# EAGLE design DCS (EAGLE 6.5.0)

## Sheet 1 of 3: Main
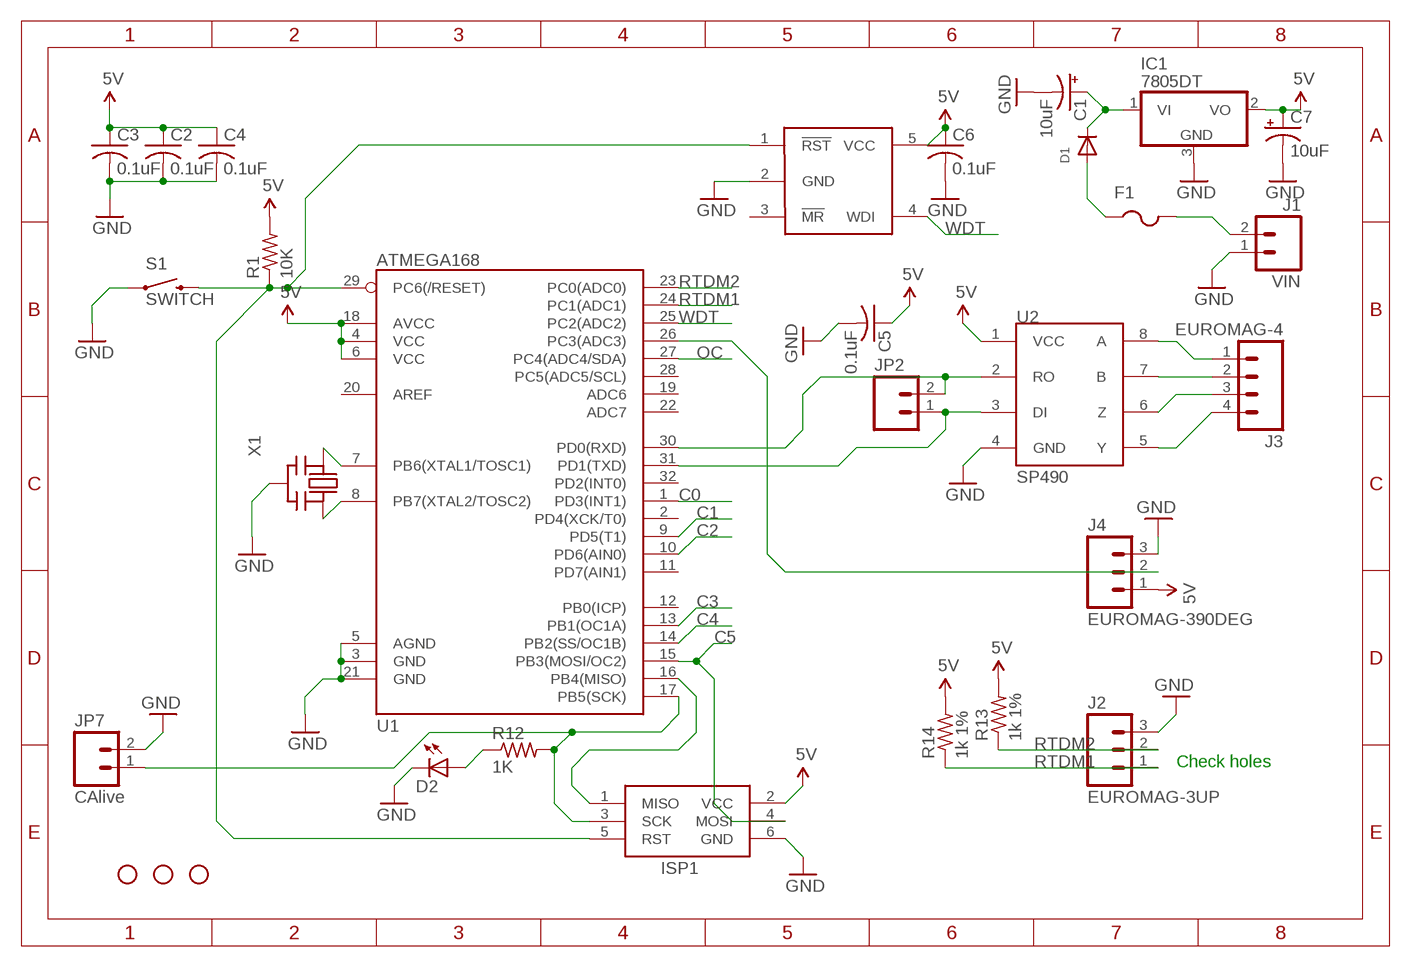
[diagram p0: schematic, sheet 1]

### Parts
C1  10uF  CPOL-USCT6032  [CT6032]
C2  0.1uF  C-USC0805  [C0805]
C3  0.1uF  C-USC0805  [C0805]
C4  0.1uF  C-USC0805  [C0805]
C5  0.1uF  C-USC0805  [C0805]
C6  0.1uF  C-USC0805  [C0805]
C7  10uF  CPOL-USCT3216  [CT3216]
D1  DIODESMA  [SMADIODE]
D2  LEDCHIPLED_0805  [CHIPLED_0805]
F1  PTCFUSE-1206  [R1206]
IC1  7805DT  [TO252]
ISP1  AVRISP-6  [AVRISP]
J1  VIN  EUROMAG-290DEG  [M2]
J2  EUROMAG-3UP  [M3-UP]
J3  EUROMAG-4  [M4]
J4  EUROMAG-390DEG  [M3]
JP1  STAND-OFF  [STAND-OFF]
JP2  M02LOCK  [1X02_LOCK]
JP3  STAND-OFF  [STAND-OFF]
JP5  STAND-OFF  [STAND-OFF]
JP7  CAlive  M02POLAR_LOCK  [MOLEX-1X2_LOCK]
R1  10K  R-US_M0805  [M0805]
R12  1K  R-US_M0805  [M0805]
R13  1k 1%  R-US_M0805  [M0805]
R14  1k 1%  R-US_M0805  [M0805]
S1  SWITCH  SWITCH-MOMENTARY-2PTH  [TACTILE-PTH]
U1  ATMEGA168  [TQFP32-08]
U2  SP490  ISL83077  [SO08]
U3  MAX823  [SOT23-5L]
X1  CERMOSCILL-AWCSR  [AWCSR]

### Nets
5V: C2.1 C3.1 C4.1 C5.1 C6.1 C7.+ IC1.2(VO) ISP1.2(VCC) J4.1 R1.2 R13.2 R14.2 U1.4(VCC) U1.6(VCC) U1.18(AVCC) U2.1(VCC) U3.5(VCC) ; also sheet 2
C0: U1.1(PD3(INT1)) ; also sheet 2
C1: U1.9(PD5(T1)) ; also sheet 2
C2: U1.10(PD6(AIN0)) ; also sheet 2
C3: U1.13(PB1(OC1A)) ; also sheet 2
C4: U1.14(PB2(SS/OC1B)) ; also sheet 2
C5: ISP1.4(MOSI) U1.15(PB3(MOSI/OC2)) ; also sheet 2
GND: C1.- C2.2 C3.2 C4.2 C5.2 C6.2 C7.- D2.C IC1.3(GND) ISP1.6(GND) J1.1 J2.3 J4.3 JP7.2 S1.1 U1.3(GND) U1.5(AGND) U1.21(GND) U2.4(GND) U3.2(GND) X1.2(GND) ; also sheet 2,3
N$1: JP2.2 U1.30(PD0(RXD)) U2.2(RO)
N$2: F1.2 J1.2
N$3: JP2.1 U1.31(PD1(TXD)) U2.3(DI)
N$4: ISP1.5(RST) R1.1 S1.3 U1.29(PC6(/RESET)) U3.1(!RST)
N$5: U1.8(PB7(XTAL2/TOSC2)) X1.3(OUT)
N$6: J3.1 U2.8(A)
N$7: ISP1.1(MISO) U1.16(PB4(MISO))
N$8: D1.A F1.1
N$9: U1.7(PB6(XTAL1/TOSC1)) X1.1(IN)
N$10: D2.A R12.1
N$11: J3.2 U2.7(B)
N$12: J3.3 U2.6(Z)
N$13: C1.+ D1.C IC1.1(VI)
N$15: J3.4 U2.5(Y)
N$17: J4.2 U1.26(PC3(ADC3))
OC: U1.27(PC4(ADC4/SDA)) ; also sheet 3
RTDM1: J2.1 R14.1 U1.24(PC1(ADC1))
RTDM2: J2.2 R13.1 U1.23(PC0(ADC0))
SCLK: ISP1.3(SCK) JP7.1 R12.2 U1.17(PB5(SCK))
WDT: U1.25(PC2(ADC2)) U3.4(WDI)
Unconnected: U1.2(PD4(XCK/T0)) U1.11(PD7(AIN1)) U1.12(PB0(ICP)) U1.19(ADC6) U1.20(AREF) U1.22(ADC7) U1.28(PC5(ADC5/SCL)) U1.32(PD2(INT0)) U3.3(!MR)

### Notes on the sheet
- Check holes

## Sheet 2 of 3: PWM
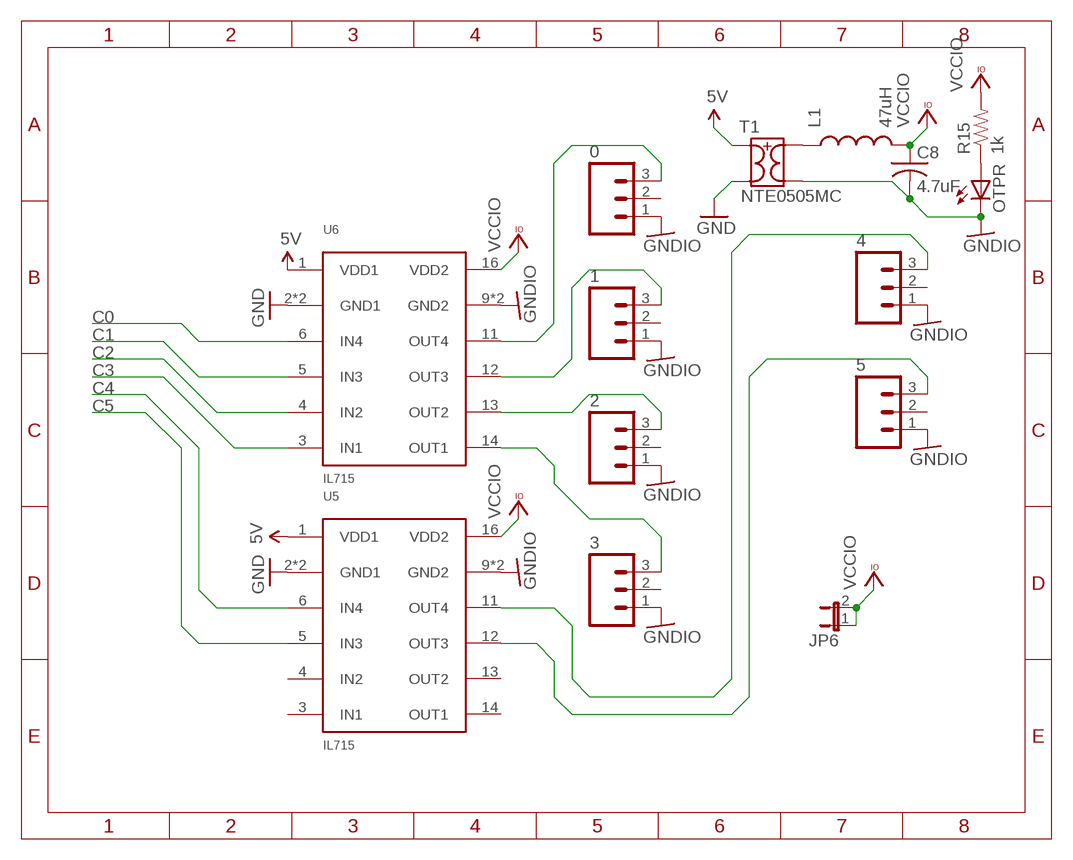
[diagram p1: schematic, sheet 2]

### Parts
0  M03PTH  [1X03]
1  M03PTH  [1X03]
2  M03PTH  [1X03]
3  M03PTH  [1X03]
4  M03PTH  [1X03]
5  M03PTH  [1X03]
C8  4.7uF  C-USC0805  [C0805]
JP6  JUMPER-2SMD-NO  [SJ_2S-NO]
L1  47uH  INDUCTOR1  [0805]
OTPR  LEDCHIP-LED0805  [CHIP-LED0805]
R15  1k  RESISTOR0805-RES  [0805]
T1  NTE0505MC  [SO-8FT]
U5  IL715  [S016]
U6  IL715  [S016]

### Nets
5V: T1.3 U5.1(VDD1) U6.1(VDD1) ; also sheet 1
C0: U6.6(IN4) ; also sheet 1
C1: U6.5(IN3) ; also sheet 1
C2: U6.4(IN2) ; also sheet 1
C3: U6.3(IN1) ; also sheet 1
C4: U5.6(IN4) ; also sheet 1
C5: U5.5(IN3) ; also sheet 1
GND: T1.1 U5.2(GND1) U5.8(GND1) U6.2(GND1) U6.8(GND1) ; also sheet 1,3
GNDIO: 0.1 1.1 2.1 3.1 4.1 5.1 C8.2 OTPR.C T1.7 U5.9(GND2) U5.15(GND2) U6.9(GND2) U6.15(GND2)
N$14: OTPR.A R15.1
N$16: L1.1 T1.8
N$32: 0.3 U6.11(OUT4)
N$33: 2.3 U6.13(OUT2)
N$35: 3.3 U6.14(OUT1)
N$36: 4.3 U5.11(OUT4)
N$37: 5.3 U5.12(OUT3)
N$38: 1.3 U6.12(OUT3)
VCCIO: C8.1 JP6.1 JP6.2 L1.2 R15.2 U5.16(VDD2) U6.16(VDD2)
Unconnected: 0.2 1.2 2.2 3.2 4.2 5.2 U5.3(IN1) U5.4(IN2) U5.13(OUT2) U5.14(OUT1)

## Sheet 3 of 3: Offset motor control
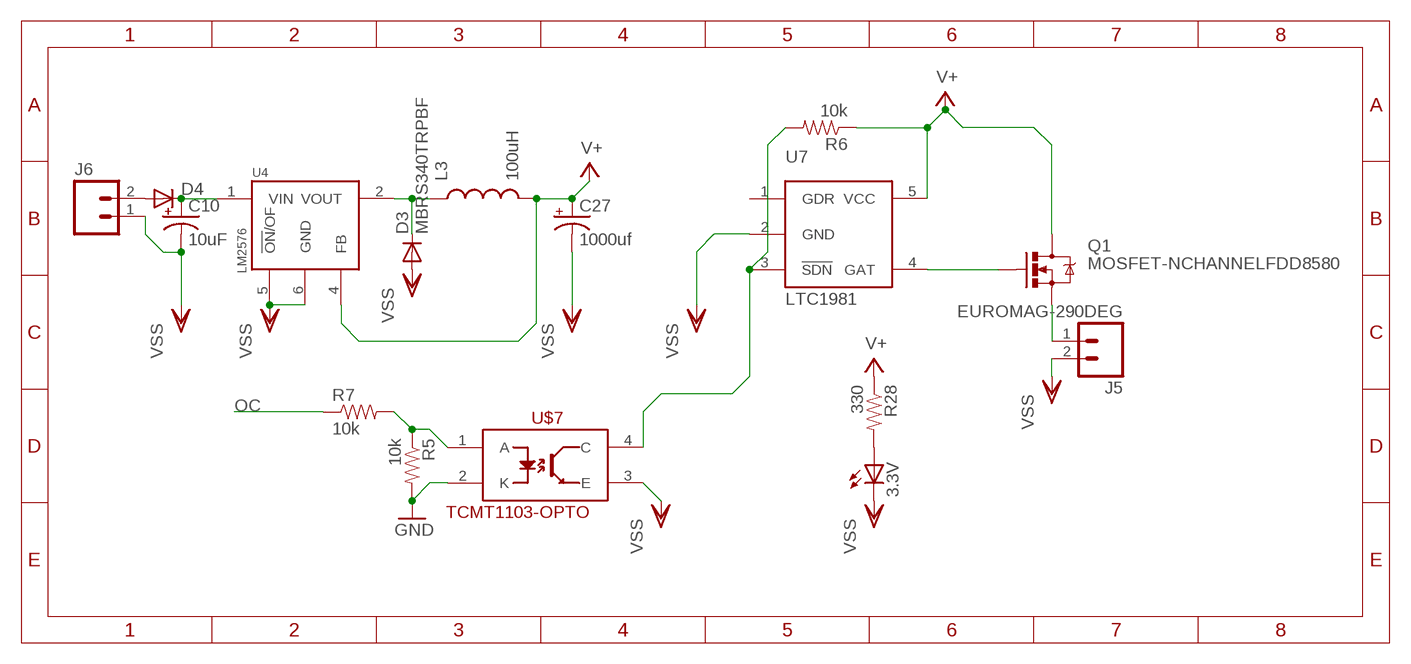
[diagram p2: schematic, sheet 3]

### Parts
3.3V  LEDCHIPLED_0805  [CHIPLED_0805]
C10  10uF  CAP_POL7343  [EIA7343]
C27  1000uf  CAP_POLG  [PANASONIC_G]
D3  MBRS340TRPBF  DIODE-SMC  [SMC]
D4  DIODESMB  [SMB-DIODE]
J5  EUROMAG-290DEG  [M2]
J6  EUROMAG-290DEG  [M2]
L3  100uH  INDUCTOR  [INDUCTOR_5X3]
Q1  MOSFET-NCHANNELFDD8580  [DPAK]
R5  10k  RESISTOR0805-RES  [0805]
R6  10k  RESISTOR0805-RES  [0805]
R7  10k  RESISTOR0805-RES  [0805]
R28  330  RESISTOR0805-RES  [0805]
U4  LM2576  [TO-263-5]
U7  LTC1981  [SOT23-5L]
U$7  TCMT1103-OPTO  [SSOP-4]

### Nets
GND: R5.2 U$7.2(K) ; also sheet 1,2
N$18: D4.A J6.2
N$20: D3.C L3.1 U4.2(VOUT)
N$25: Q1.1(G) U7.4(GAT)
N$26: R6.2 U7.3(!SDN) U$7.4(C)
N$27: J5.1 Q1.3(S)
N$28: R5.1 R7.2 U$7.1(A)
N$30: 3.3V.A R28.2
OC: R7.1 ; also sheet 1
V+: C27.+ L3.2 Q1.4(D) R6.1 R28.1 U4.4(FB) U7.5(VCC)
VOLTIN: C10.A(+) D4.C U4.1(VIN)
VSS: 3.3V.C C10.C(-) C27.- D3.A J5.2 J6.1 U4.5(!ON!/OF) U4.6(GND) U7.2(GND) U$7.3(E)
Unconnected: U7.1(GDR)

## Library data of the parts
0 1-5 = SparkFun:M03: Header 3 Standard 3-pin 0.1" header. Use with straight break away headers (SKU : PRT-00116), right angle break away headers (PRT-00553), swiss pins (PRT-00743), machine pins (PRT-00117), and female headers (PRT-00115). Molex polarized connector foot print use with SKU : PRT-08232 with associated crimp pins and housings.
3.3V D2 OTPR = adafruit:LED: LED OSRAM: - CHIPLED LG R971, LG N971, LY N971, LG Q971, LY Q971, LO R971, LY R971 LH N974, LH R974 LS Q976, LO Q976, LY Q976 LO Q996 - Hyper CHIPLED LW Q18S LB Q993, LB Q99A, LB R99A - SideLED LS A670, LO A670, LY A670, LG A670, LP A670 LB A673, LV A673, LT A673, LW A673 LH A674 LY A675 LS A676, LA A676, LO A676, LY A676, LW A676 LS A679, LY A679, LG A679 - Hyper Micro SIDELED® LS Y876, LA Y876, LO Y876, LY Y876 LT Y87S - SmartLED LW L88C, LW L88S LB L89C, LB L89S, LG L890 LS L89K, LO L89K, LY L89K LS L896, LA L896, LO L896, LY L896 - TOPLED LS T670, LO T670, LY T670, LG T670, LP T670 LSG T670, LSP T670, LSY T670, LOP T670, LYG T670 LG T671, LOG T671, LSG T671 LB T673, LV T673, LT T673, LW T673 LH T674 LS T676, LA T676, LO T676, LY T676, LB T676, LH T676, LSB T676, LW T676 LB T67C, LV T67C, LT T67C, LS T67K, LO T67K, LY T67K, LW E67C LS E67B, LA E67B, LO E67B, LY E67B, LB E67C, LV E67C, LT E67C LW T67C LS T679, LY T679, LG T679 LS T770, LO T770, LY T770, LG T770, LP T770 LB T773, LV T773, LT T773, LW T773 LH T774 LS E675, LA E675, LY E675, LS T675 LS T776, LA T776, LO T776, LY T776, LB T776 LHGB T686 LT T68C, LB T68C - Hyper Mini TOPLED® LB M676 - Mini TOPLED Santana® LG M470 LS M47K, LO M47K, LY M47K Source: http://www.osram.convergy.de/
C1 C7 = adafruit:CPOL-US: POLARIZED CAPACITOR, American symbol
C2-C6 C8 = adafruit:C-US: CAPACITOR, American symbol
C10 C27 = SparkFun:CAP_POL: Capacitor Polarized These are standard SMD and PTH capacitors. Normally 10uF, 47uF, and 100uF in electrolytic and tantalum varieties. Always verify the external diameter of the through hole cap, it varies with capacity, voltage, and manufacturer. The EIA devices should be standard.
D1 = adafruit:DIODE: Diode
D3 = diode:DIODE-: DIODE
D4 = SparkFun-DiscreteSemi:DIODE: Diode
F1 = adafruit:PTCFUSE: PTC fuses, resettable thermistors
IC1 = adafruit:78*: Positive VOLTAGE REGULATOR Added bigger pads to the TO-92 package
ISP1 = adafruit:AVRISP: AVR ISP HEADER Standard 6 pin header for AVR programming
J1 J5 J6 = NASA_LIB:EUROMAG-2
J2 J4 = NASA_LIB:EUROMAG-3
J3 = NASA_LIB:EUROMAG-4
JP1 JP3 JP5 = SparkFun:STAND-OFF: Stand Off This is the mechanical footprint for a #4 phillips button head screw. Use the keepout ring to avoid running the screw head into surrounding components. SKU : PRT-00447
JP2 JP7 = SparkFun:M02: Header 2 Standard 2-pin 0.1" header. Use with straight break away headers (SKU : PRT-00116), right angle break away headers (PRT-00553), swiss pins (PRT-00743), machine pins (PRT-00117), and female headers (PRT-00115). Molex polarized connector foot print use with SKU : PRT-08233 with associated crimp pins and housings.
JP6 = SparkFun:JUMPER-2: Jumper Basic 0.1" spaced jumper. Use with breakaway headers.
L1 L3 = NASA_LIB:INDUCTOR
Q1 = SparkFun:MOSFET-NCHANNEL
R1 R12-R14 = adafruit:R-US_: RESISTOR, American symbol
R5-R7 R15 R28 = SparkFun:RESISTOR: Resistor Basic schematic elements and footprints for 0603, 1206, and PTH resistors.
S1 = SparkFun:SWITCH-MOMENTARY-2
T1 = EmEndev:NTE0505MC
U1 = SparkFun:ATMEGA168
U2 = NASA_LIB:ISL83077
U3 = NASA_LIB:MAX823
U4 = NASA_LIB:LM2576
U5 U6 = NASA_LIB:IL715
U7 = NASA_LIB:LTC1981
U$7 = SparkFun:TCMT1103-OPTO
X1 = adafruit:CERMOSCILL: Ceramic oscillator with built in capacitors such as ZTT-12MHz http://www.ladyada.net/library/eagle

## Net classes
1 power: width 0.61 mm, drill 0.711 mm, clearance 0.203 mm

## Board
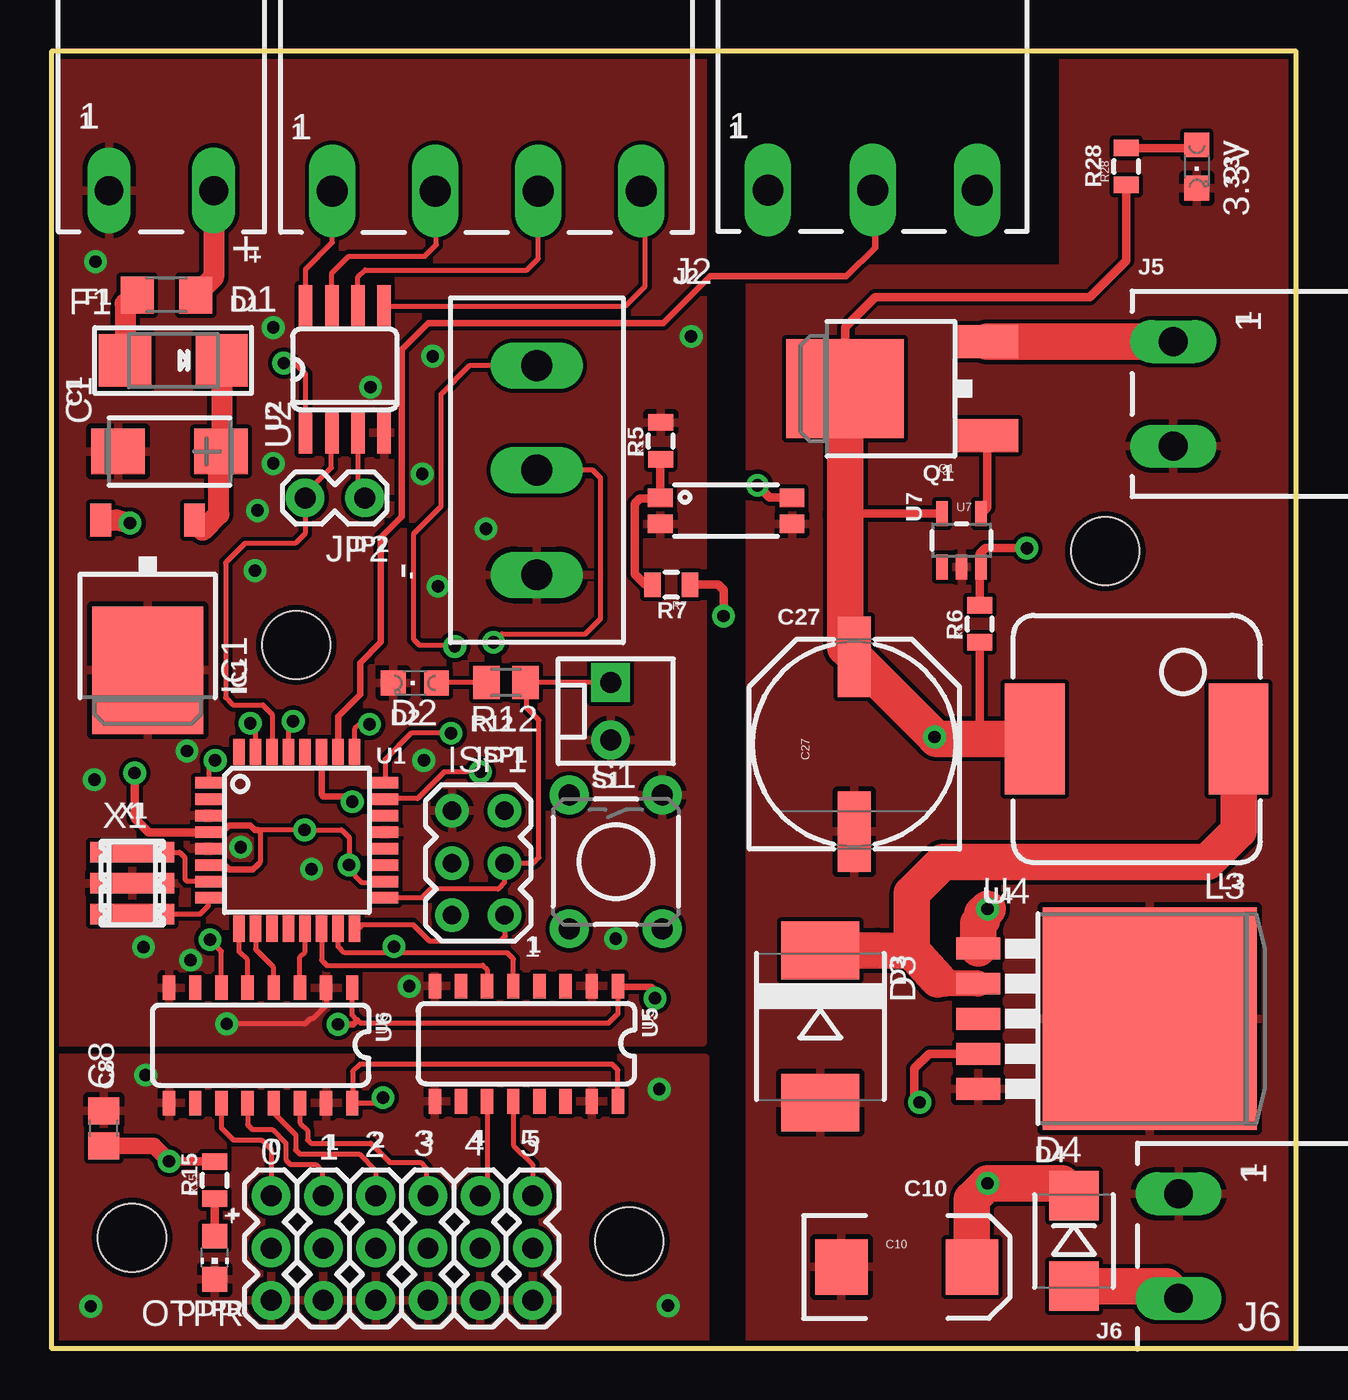
[diagram p3: board, top side]
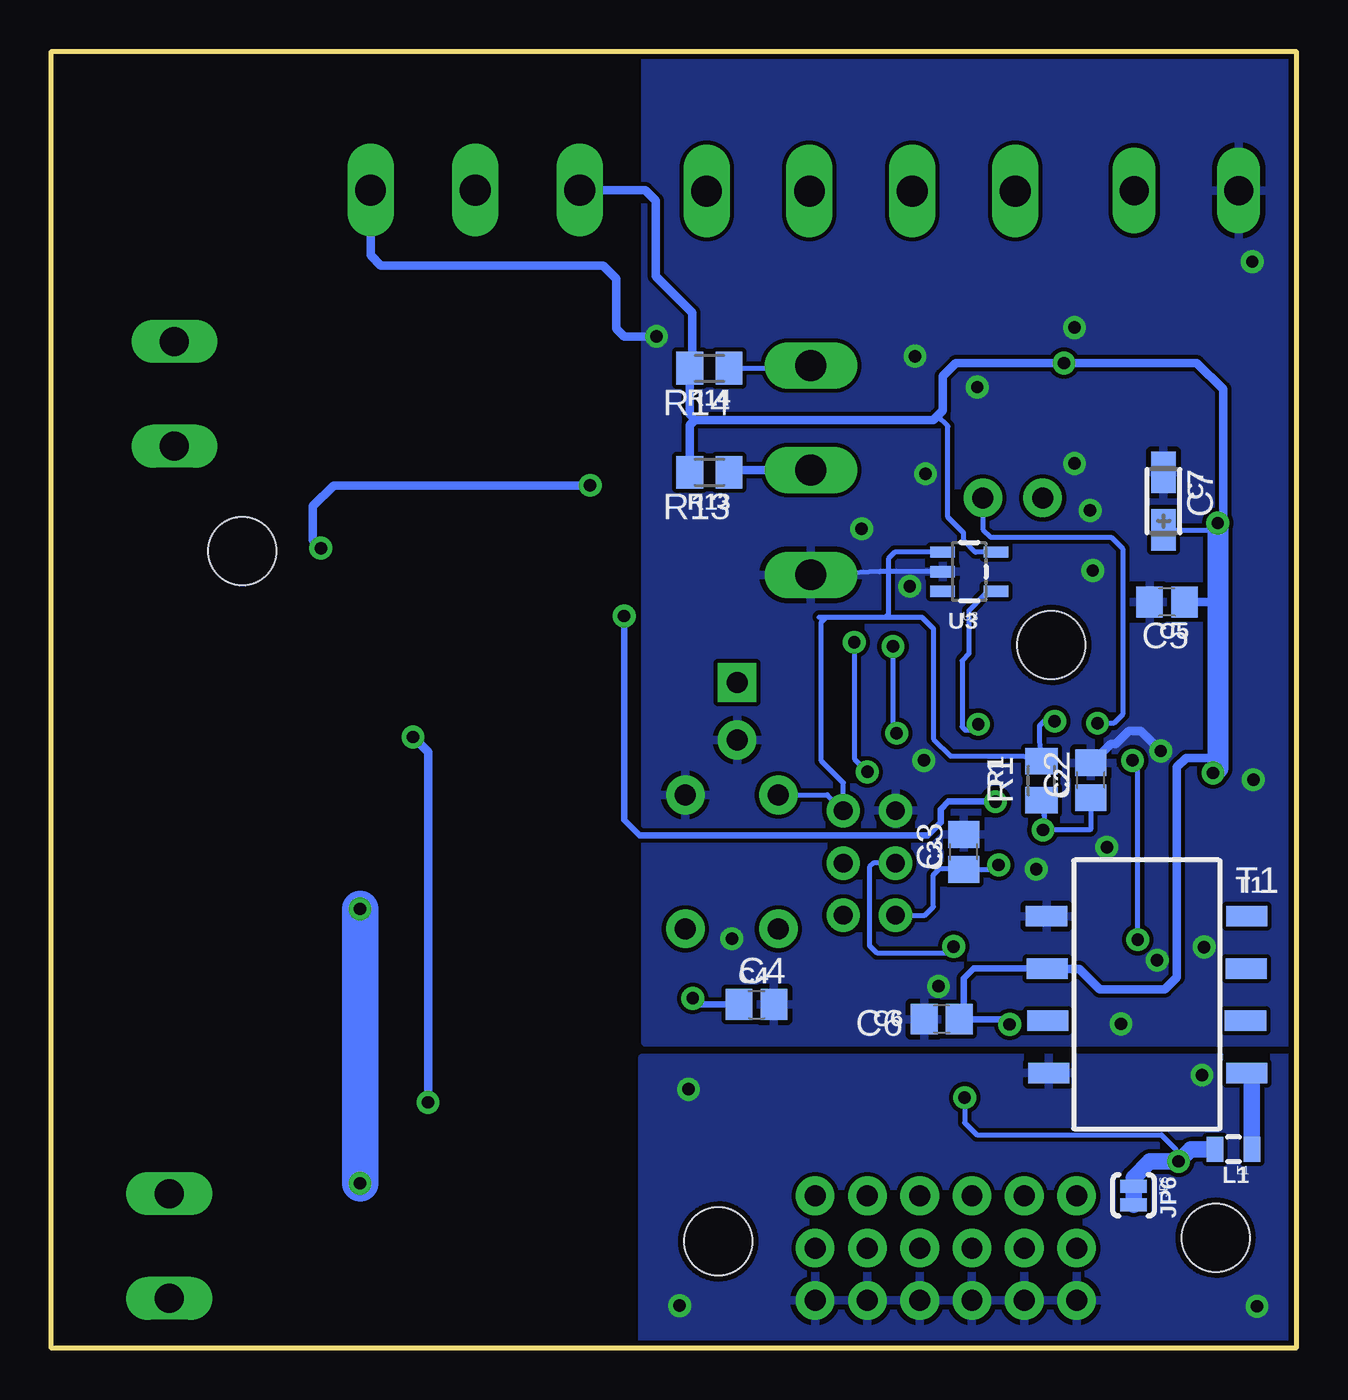
[diagram p4: board, bottom side, seen from below]

Size 60.45 x 62.99 mm. Coordinates in mm from the lower left corner, seen from the top.
Outline: 0,0 60.45,0 60.45,62.99 0,62.99 0,0
Copper layers (1*16): Top 0.035mm / dielectric 1.5mm / Bottom 0.035mm
Design rules "default": minimum track width 8mil, minimum drill 20mil, track to track 8mil, track to pad 8mil, pad to pad 8mil, via to via 8mil, smd to smd 8mil, copper to edge 10mil, drill to drill 8mil, minimum pad ring 12mil, minimum via ring 10mil, stop-mask expansion 4mil, vias tented up to drill 25mil, thermal gap 10mil

### Footprints (pad centres in the part's own frame; a part is rotated, then mirrored left to right if it is on the bottom)
1X03 = drill 1.016 pad 1.88: 1 0,0; 2 2.54,0; 3 5.08,0
CHIPLED_0805 = smd 1.2 x 1.2: A 0,-1.05; C 0,1.05
CT6032 = smd 2.6 x 2.2: + 2.5,0; - -2.5,0
C0805 = smd 1.3 x 1.5: 1 -0.85,0; 2 0.85,0
CT3216 = smd 2 x 1.2: + 1.4,0; - -1.4,0
EIA7343 = smd 2.55 x 2.7: A 3.17,0; C -3.17,0
PANASONIC_G = smd 3.9 x 1.6: + 4.25,0; - -4.25,0
SMADIODE = smd 2.54 x 2.54: A 2.349,0; C -2.349,0
SMC = smd 2.8 x 3.8: A 3.7,0; C -3.7,0
SMB-DIODE = smd 2.4 x 2.4: A 2.2,0; C -2.2,0
R1206 = smd 1.6 x 1.803: 1 -1.422,0; 2 1.422,0
TO252 = smd 1 x 1.6: 1 -2.28,-4.8; 2 2.28,-4.8 | smd 5.4 x 6.2: 3 0,2.5
AVRISP = drill 0.9 pad 1.626: 1 -1.27,2.54; 2 1.27,2.54; 3 -1.27,0; 4 1.27,0; 5 -1.27,-2.54; 6 1.27,-2.54
M2 = drill 1.4 long: 1 -2.54,0; 2 2.54,0
M3-UP = drill 1.5 long: 1 -5.08,0; 2 0,0; 3 5.08,0
M4 = drill 1.5 long: 1 0,0; 2 5,0; 3 10,0; 4 15,0
M3 = drill 1.5 long: 1 -5.08,0; 2 0,0; 3 5.08,0
STAND-OFF = hole 3.302: 0,0
1X02_LOCK = drill 1.016 pad 1.88: 1 -0.178,0; 2 2.718,0
SJ_2S-NO = smd 0.635 x 1.27: 1 -0.45,0; 2 0.45,0
MOLEX-1X2_LOCK = drill 1.016 pad 1.88 square: 1 -0.127,0 | drill 1.016 pad 1.88: 2 2.667,0
0805 = smd 0.8 x 1.2: 1 -0.9,0; 2 0.9,0
INDUCTOR_5X3 = smd 2.9 x 5.4: 1 -4.95,0; 2 4.95,0
CHIP-LED0805 = smd 1.2 x 1.2: A 0,-1.05; C 0,1.05
DPAK = smd 1.6 x 3: 1 -2.28,-5.31; 3 2.28,-5.31 | smd 4.826 x 5.715: 4 0,1.588
M0805 = smd 1.3 x 1.6: 1 -0.95,0; 2 0.95,0
TACTILE-PTH = drill 1.016 pad 1.88: 1 -3.251,2.261; 2 3.251,2.261; 3 -3.251,-2.261; 4 3.251,-2.261
SO-8FT = smd 1 x 2: 1 -3.81,-4.91; 3 -1.27,-4.88; 5 1.27,-4.85; 7 3.81,-4.81; 8 3.81,4.81; 10 1.27,4.75; 12 -1.27,4.78; 14 -3.81,4.81
TQFP32-08 = smd 1.27 x 0.559: 1 -4.293,2.8; 2 -4.293,2; 3 -4.293,1.2; 4 -4.293,0.4; 5 -4.293,-0.4; 6 -4.293,-1.2; 7 -4.293,-2; 8 -4.293,-2.8; 17 4.293,-2.8; 18 4.293,-2; 19 4.293,-1.2; 20 4.293,-0.4; 21 4.293,0.4; 22 4.293,1.2; 23 4.293,2; 24 4.293,2.8 | smd 0.559 x 1.27: 9 -2.8,-4.293; 10 -2,-4.293; 11 -1.2,-4.293; 12 -0.4,-4.293; 13 0.4,-4.293; 14 1.2,-4.293; 15 2,-4.293; 16 2.8,-4.293; 25 2.8,4.293; 26 2,4.293; 27 1.2,4.293; 28 0.4,4.293; 29 -0.4,4.293; 30 -1.2,4.293; 31 -2,4.293; 32 -2.8,4.293
SO08 = smd 0.66 x 2.032: 1 -1.905,-3.073; 2 -0.635,-3.073; 3 0.635,-3.073; 4 1.905,-3.073; 5 1.905,3.073; 6 0.635,3.073; 7 -0.635,3.073; 8 -1.905,3.073
SOT23-5L = smd 0.55 x 1.2: 1 -0.95,-1.3; 2 0,-1.3; 3 0.95,-1.3; 4 0.95,1.3; 5 -0.95,1.3
TO-263-5 = smd 1.067 x 2.159: 1 -3.404,-7.061; 2 -1.702,-7.061; 3 0,-7.061; 4 1.702,-7.061; 5 3.404,-7.061 | smd 10.8 x 10.41: 6 0,1.27
S016 = smd 0.6 x 1.2: 1 -4.445,-2.8; 2 -3.175,-2.8; 3 -1.905,-2.8; 4 -0.635,-2.8; 5 0.635,-2.8; 6 1.905,-2.8; 7 3.175,-2.8; 8 4.445,-2.8; 9 4.445,2.8; 10 3.175,2.8; 11 1.905,2.8; 12 0.635,2.8; 13 -0.635,2.8; 14 -1.905,2.8; 15 -3.175,2.8; 16 -4.445,2.8
SSOP-4 = smd 1.2 x 0.9: 1 -3.2,0.67; 2 -3.2,-0.6; 3 3.2,-0.6; 4 3.2,0.67
AWCSR = smd 1 x 4.1: 1 -1.5,0; 2 0,0; 3 1.5,0

### Placement (x,y rotation side)
0  10.67,2.31 90 top
1  13.21,2.31 90 top
2  15.75,2.31 90 top
3  18.29,2.31 90 top
3.3V  55.63,57.4 180 top
4  20.83,2.31 90 top
5  23.37,2.31 90 top
C1  5.74,43.56 0 top
C2  9.98,27.58 90 bottom
C3  16.15,24.1 90 bottom
C4  26.21,16.69 0 bottom
C5  6.27,36.25 180 bottom
C6  17.22,15.98 180 bottom
C7  6.45,41.15 270 bottom
C8  2.54,10.67 90 top
C10  41.53,3.94 0 top
C27  38.99,29.34 90 top
D1  5.92,47.98 180 top
D2  17.65,32.31 90 top
D3  37.34,15.62 270 top
D4  49.66,5.21 270 top
F1  5.59,51.16 0 top
IC1  4.67,35.43 180 top
ISP1  20.73,23.57 180 top
J1  5.33,56.24 0 top
J2  23.57,42.65 270 top
J3  13.64,56.21 0 top
J4  39.88,56.26 0 top
J5  54.48,46.35 270 top
J6  54.74,4.95 270 top
JP1  11.89,34.16 0 top
JP2  15.04,41.3 180 top
JP3  3.91,5.36 0 top
JP4  STAND-OFF  [STAND-OFF]  28.07,5.18 0 top
JP5  51.18,38.71 0 top
JP6  7.9,7.42 270 bottom
JP7  27.15,32.21 270 top
L1  3.05,9.65 180 bottom
L3  52.7,29.59 180 top
OTPR  7.92,4.39 180 top
Q1  40.13,46.61 90 top
R1  12.37,27.56 270 bottom
R5  29.59,44.07 90 top
R6  45.09,35.18 90 top
R7  30.1,37.08 180 top
R12  22.07,32.33 0 top
R13  28.5,42.55 180 bottom
R14  28.5,47.6 180 bottom
R15  7.92,8.15 90 top
R28  52.2,57.4 90 top
S1  27.41,23.62 270 top
T1  7.21,17.17 270 bottom
U1  11.92,24.67 0 top
U2  14.25,47.55 0 top
U3  15.88,37.72 270 bottom
U4  52.07,16 270 top
U5  23.06,14.78 180 top
U6  10.16,14.71 180 top
U7  44.2,39.24 0 top
U$7  32.77,40.64 0 top
X1  3.92,22.58 270 top

### Tracks (layer width: path | path; a pad name or v marks a point on that pad's centre or on a via)
5V  (via drill 0.6)
  Top 0.254: U5.1 27.51,16.23 27.05,15.77 15.01,15.77 14.86,15.93 14.61,16.18 U6.1 | 10.01,23.47 10.16,23.62 10.16,25.02 10.01,25.17 v12.29,25.17 14.1,25.17 14.45,24.82 v14.45,23.47 14.45,23.22 15.04,22.63 16.17,22.63 U1.18 | 7.78,25.17 U1.4 | U2.1 12.34,47.32 11.81,47.85 v11.28,47.85
  Top 0.305: v13.92,15.72 14.66,15.72 14.86,15.93 | v29.31,16.99 29.31,17.37 29.13,17.55 27.54,17.55 U5.1 | 10.01,25.17 9.88,25.17 9.65,25.4 8.64,25.4 8.38,25.15 7.7,25.15 U1.4 | U1.6 8.41,23.47 8.64,23.24 9.78,23.24 10.01,23.47
  Top 0.406: v4.04,27.94 4.04,25.73 4.72,25.04 7.6,25.04 U1.4
  Top 1.016: IC1.2 3.15,40.23 v3.81,40.08
  Bottom 0.254: v14.45,23.47 14.67,23.25 C3.1 16.19,23.29 17.32,23.29 17.63,22.99 17.63,21.44 18.04,21.03 ISP1.2 | C2.1 9.98,25.2 10.01,25.17 v12.29,25.17 12.24,25.88 R1.2 | U3.5 15.58,38.67 16.15,39.24 16.15,39.6 16.92,40.36 16.92,44.78 17.42,45.29 | C7.+ 3.98,39.75 v3.81,40.08
  Bottom 0.305: v13.92,15.72 14.17,15.98 C6.1 16.15,16.19 16.15,17.96 15.67,18.44 T1.3 12.06,18.44 | C4.1 29.01,16.69 v29.31,16.99
  Bottom 0.406: C5.1 3.83,36.25 3.81,36.27 | 3.81,28.78 3.91,28.68 5.33,28.68 5.79,28.22 5.79,18.01 6.38,17.42 9.55,17.42 10.54,18.41 12.07,18.41 T1.3 | v3.81,40.08 3.56,39.83 3.56,46.58 4.83,47.85 v11.28,47.85 16.54,47.85 17.17,47.22 17.17,45.54 17.42,45.29 17.63,45.09 29.21,45.09 | J4.1 31.62,56.26 31.11,55.75 31.11,52.07 29.34,50.29 29.34,47.71 R14.2 29.46,47.58 29.46,45.34 29.21,45.09 | R13.2 29.45,44.85 29.21,45.09
  Bottom 1.016: v3.81,40.08 3.81,36.27 3.81,28.78 3.81,28.17 v4.04,27.94
C0  (via drill 0.6)
  Top 0.254: U6.6 8.26,19.28 v7.7,19.84 | v7.95,28.55 7.85,28.55 7.64,28.35 7.64,27.49 U1.1
  Bottom 0.254: v7.7,19.84 7.7,28.45 v7.95,28.55
C1
  Top 0.254: U6.5 9.53,18.85 9.12,19.25 U1.9
C2
  Top 0.254: U1.10 9.92,19.37 10.77,18.52 10.77,17.53 U6.4
C3
  Top 0.254: U6.3 12.06,19 12.32,19.25 U1.13
C4
  Top 0.254: U1.14 13.12,18.84 13.36,18.59 20.95,18.59 21.16,18.39 U5.6
C5  (via drill 0.6)
  Top 0.254: U5.5 22.43,18.9 22.12,19.2 16.43,19.2 | 16.43,19.2 14.22,19.2 13.92,19.51 U1.15 | v16.64,19.51 16.64,19.41 16.43,19.2
  Bottom 0.254: ISP1.4 20.53,23.57 20.73,23.37 20.73,19.56 20.37,19.2 16.89,19.2 v16.64,19.51
GND  (via drill 0.6)
  Top 0.254: U6.2 13.34,16.64 12.7,16 12.57,16 12.32,15.75 v8.51,15.75 | U1.3 7.62,25.9 7.62,25.91
  Bottom 0.254: U3.2 20.24,37.72 J2.3 | C7.- 6.45,42.6 6.3,42.75
  Bottom 0.406: J4.3 44.96,53.09 44.45,52.58 33.66,52.58 33.02,51.94 33.02,49.53 32.64,49.15 v31.06,49.15 | C2.2 9.92,28.43 9.02,29.34 8.76,29.34 8.13,29.97 7.54,29.97 v6.58,29.01
  other vias: 17.37,17.58 9.19,24.33 12.62,23.27 9.88,37.77 2.08,27.61 2.13,52.78 10.77,49.58 15.49,46.69 21.11,39.8 18.08,28.55 27.41,19.89 4.47,19.48 10.77,42.98 18.77,37.01 10.01,40.69 18.52,48.18 18.01,42.47 6.76,18.85
  pour Top: -0.13,62.87 31.62,62.87 31.62,14.86 -0.13,14.86
  pour Bottom: 0,62.99 31.62,62.99 31.62,14.86 0,14.86
GNDIO  (via drill 0.6)
  other vias: 4.57,13.26 1.91,2.03 29.95,2.06 29.51,12.57
  pour Bottom: 0,14.1 31.75,14.1 31.75,0 0,0
  pour Top: 0,14.1 31.75,14.1 31.75,0 0,0
N$1
  Top 0.254: U1.30 10.72,30.79 10.26,31.24 8.81,31.24 8.46,31.6 8.46,38.15 9.4,39.09 11.84,39.09 12.32,39.57 JP2.2 12.32,41.5 13.59,42.77 13.59,44.2 13.61,44.22 U2.2
N$2
  Top 1.016: J1.2 7.87,52.02 F1.2
N$3  (via drill 0.6)
  Top 0.254: 9.96,29 U1.31 9.91,28.97 9.91,30.23 9.78,30.35 v9.65,30.35 | U2.3 14.88,41.5 JP2.1
  Bottom 0.254: JP2.1 15.21,39.78 14.83,39.4 8.99,39.4 8.43,38.84 8.43,30.79 8.87,30.35 v9.65,30.35
N$4  (via drill 0.6)
  Top 0.254: U1.29 11.52,30.24 v11.73,30.45
  Bottom 0.254: S1.3 22.77,26.87 ISP1.5 22,27.46 23.06,28.52 23.06,35.28 22.84,35.51 | 23.16,35.51 22.84,35.51 | 22.84,35.51 19.94,35.51 | 19.94,35.51 18.19,35.51 17.63,34.95 17.63,29.59 16.79,28.75 13.27,28.75 R1.1 12.47,29.5 12.47,30.23 12.24,30.45 v11.73,30.45 | U3.1 19.5,38.67 19.81,38.35 19.81,35.64 19.94,35.51
N$5
  Top 0.254: X1.3 7.21,21.08 7.62,21.49 U1.8
N$6
  Top 0.254: U2.8 12.34,52.43 13.64,53.72 J3.1
N$7
  Top 0.254: ISP1.1 22.05,20.98 22.05,20.02 21.82,19.79 18.34,19.79 17.55,20.57 15.11,20.57 14.91,20.38 U1.16
N$8
  Top 1.016: F1.1 4.01,51.16 3.58,50.72 3.58,47.99 D1.A
N$9
  Top 0.254: X1.1 6.22,24.08 6.48,23.82 6.48,22.78 6.58,22.68 7.61,22.68 U1.7
N$10
  Top 0.254: R12.1 18.73,32.33 D2.A
N$11
  Top 0.254: U2.7 13.61,52.22 14.43,53.03 18.14,53.03 18.69,53.59 18.69,56.16 J3.2
N$12
  Top 0.254: U2.6 14.88,52.05 15.21,52.38 23.09,52.38 23.65,52.93 J3.3
N$13
  Top 1.016: D1.C 8.27,43.59 C1.+ 8.34,43.66 8.53,43.66 8.13,43.26 8.13,40.51 7.34,39.73 IC1.1
N$14
  Top 0.406: R15.1 OTPR.A
N$15
  Top 0.254: U2.5 27.86,50.62 28.83,51.59 28.83,56.02 J3.4
N$16
  Bottom 0.813: T1.8 2.15,13.36 L1.1
N$17
  Top 0.305: U1.26 13.92,30.68 14.99,31.75 14.99,33.27 16,34.29 16,39.37 17.02,40.39 17.02,48.51 18.29,49.78 29.72,49.78 32,52.07 38.61,52.07 40.01,53.47 40.01,56.13 J4.2
N$18
  Top 1.778: D4.A 54.14,3.01 J6.2
N$20
  Top 1.27: U4.2 43.38,17.7 43.05,17.91
  Top 1.778: D3.C 40.12,19.32 41.78,19.3 | 43.05,17.91 41.78,19.3 | 41.78,19.3 41.78,22.1 43.31,23.62 56.13,23.62 57.66,25.15 57.66,28.7 57.91,28.96 57.91,29.33 L3.1
N$25
  Top 0.406: Q1.1 45.44,40.84 U7.4
N$26  (via drill 0.6)
  Top 0.406: R6.2 45.09,37.88 U7.3 45.09,38 45.09,38.61 45.34,38.86 v47.37,38.86 | U$7.4 34.89,41.31 v34.29,41.91
  Bottom 0.406: v34.29,41.91 46.74,41.91 47.75,40.89 47.75,39.24 v47.37,38.86
N$27
  Top 1.778: Q1.3 J5.1
N$28
  Top 0.406: R7.2 28.83,37.08 28.32,37.59 28.32,41.02 28.57,41.27 29.53,41.27 U$7.1 29.57,43.14 R5.1
N$30
  Top 0.406: R28.2 55.48,58.3 3.3V.A
N$32
  Top 0.254: U6.11 8.26,10.69 8.84,10.11 10.21,10.11 10.67,9.65 0.3
N$33
  Top 0.254: U6.13 10.79,11.43 11.86,10.36 11.86,9.63 12.06,9.42 14.94,9.42 15.75,8.61 2.3
N$35
  Top 0.254: U6.14 12.06,10.95 12.45,10.57 12.45,10.11 12.6,9.96 15.49,9.96 16.43,9.02 17.93,9.02 18.21,8.74 18.21,7.47 3.3
N$36
  Top 0.254: U5.11 21.16,7.72 4.3
N$37
  Top 0.254: U5.12 22.43,9.86 23.37,8.91 5.3
N$38
  Top 0.254: U6.12 9.53,10.85 9.75,10.62 10.72,10.62 11.38,9.96 11.38,9.14 11.61,8.91 12.83,8.91 13.16,8.59 13.16,7.44 1.3
OC  (via drill 0.6)
  Top 0.305: U1.27 13.12,26.89 13.21,26.8 14.35,26.8 v14.61,26.54
  Top 0.406: R7.1 32.38,37.08 32.64,36.83 v32.64,35.56
  Bottom 0.305: v14.61,26.54 16.89,26.54 17.27,26.16 17.27,25.53 17.91,24.89 31.88,24.89 32.64,25.65 v32.64,35.56
RTDM1  (via drill 0.6)
  Top 0.254: v19.58,34.09 19.51,34.16 17.86,34.16 17.6,34.42 17.6,39.57 18.92,40.89 18.92,46.35 20.32,47.75 23.55,47.75 J2.1 | v19.41,29.87 17.48,29.87 16.2,28.6 U1.24
  Bottom 0.254: v19.58,34.09 19.58,30.05 v19.41,29.87 | R14.1 23.7,47.6 J2.1
RTDM2  (via drill 0.6)
  Top 0.254: v21.46,34.29 21.87,34.7 25.93,34.7 26.67,35.43 26.67,42.27 26.29,42.65 J2.2 | v20.83,27.99 19.07,27.99 17.78,26.7 16.24,26.7 U1.23
  Bottom 0.254: v21.46,34.29 21.46,28.63 v20.83,27.99
  Bottom 0.406: J2.2 27.45,42.65 R13.1
SCLK
  Top 0.254: U1.17 17.98,21.87 18.41,22.3 21.69,22.3 22,22.61 ISP1.3 23.41,23.57 23.67,23.82 23.67,30.5 23.09,31.09 23.09,32.27 R12.2 JP7.1
V+  (via drill 0.6)
  Top 0.406: U7.5 38.57,40.54 38.54,40.51 | Q1.4 38.54,49.59 40.01,51.05 50.42,51.05 52.2,52.83 R28.1 | U4.4 42.62,14.3 41.91,13.59 41.91,12.19 v42.16,11.94 | R6.1 45.09,29.59
  Top 1.778: Q1.4 38.54,40.51 38.54,34.03 C27.+ v42.89,29.68 42.98,29.59 45.09,29.59 L3.2
  Bottom 0.406: v42.16,11.94 42.16,28.96 v42.89,29.68
VCCIO  (via drill 0.6)
  Top 0.254: U5.16 27.51,13.51 27.23,13.79 14.99,13.79 14.63,13.44 14.63,11.93 U6.16 15.84,11.91 v16.1,12.17
  Top 0.406: v5.71,9.07 7.91,9.07 R15.2
  Top 0.813: C8.1 4.96,9.82 v5.71,9.07
  Bottom 0.254: v16.1,12.17 16.1,10.95 15.52,10.36 6.55,10.36 5.84,9.65 5.84,9.2 v5.71,9.07
  Bottom 0.406: 5.59,8.94 v5.71,9.07
  Bottom 0.813: L1.2 5.13,9.65 v5.71,9.07 7.11,9.07 7.9,8.28 JP6.1 JP6.2
VOLTIN  (via drill 0.6)
  Top 1.778: U4.1 45.01,20.62 45.21,20.83 45.21,21.08 v45.47,21.34 | D4.C 49.06,8 v45.47,8 44.7,7.23 C10.A
  Bottom 1.778: v45.47,21.34 v45.47,8
VSS
  pour Top: 33.91,-0.13 60.45,-0.13 60.45,63.12 49.15,63.12 49.15,52.45 33.91,52.45
WDT  (via drill 0.6)
  Top 0.254: v15.44,30.3 14.94,30.3 14.71,30.07 14.71,28.63 14.73,28.6 14.73,28.95 U1.25
  Bottom 0.254: U3.4 14.97,36.77 15.9,35.84 15.9,33.73 16.23,33.4 16.23,30.18 16.08,30.02 15.72,30.02 v15.44,30.3

### Text on the board
tPlace: + | -
_tsilk: J4 | 1 | 1 | 1 | 3.3V | R28 | + | J2 | J5 | F1 | D1 | 1 | C1 | U2 | R5 | Q1 | U7 | JP2 | - | R7 | C27 | R6 | IC1 | D2 | R12 | ISP1 | U1 | X1 | S1 | L3 | U4 | 1 | D3 | U5 | U6 | C8 | 2 | 3 | 4 | 5 | 0 | 1 | D4 | 1 | R15 | + | C10 | OTPR | J6
_bsilk: R14 | C7 | R13 | U3 | C5 | R1 | C2 | C3 | T1 | C4 | C6 | L1 | JP6